# Altium project ROBO_PCB.PrjPcb
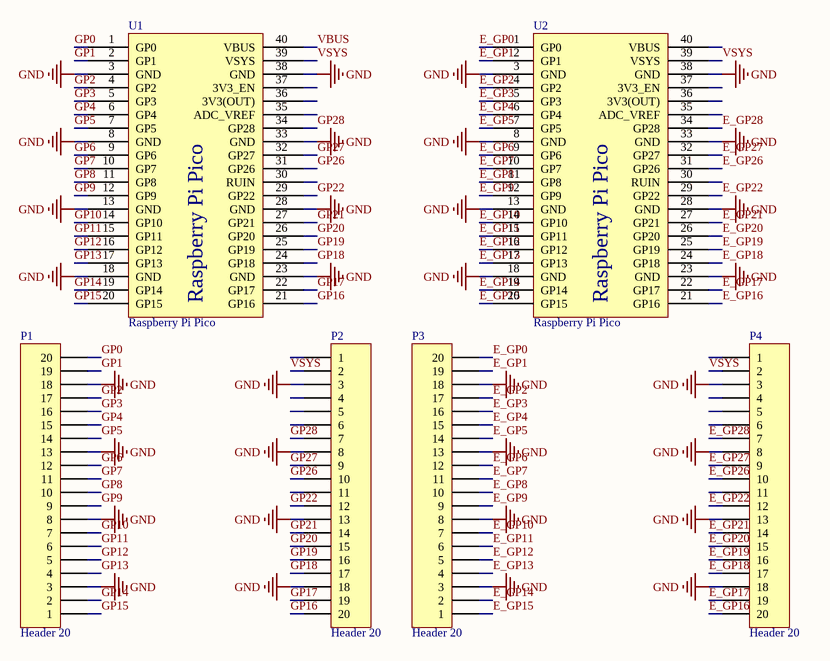
[diagram p0: PCBSchematic.SchDoc]
1 sheet, 6 parts. Net scope: global (net labels, ports and power ports of the same name join across sheets).

## Sheet PCBSchematic.SchDoc
size Letter; SheetNumber: 1; SheetTotal: 1

### Parts
P1  Header 20  [HDR1X20]
P2  Header 20  [HDR1X20]
P3  Header 20  [HDR1X20]
P4  Header 20  [HDR1X20]
U1  Raspberry Pi Pico  [Raspberry Pi Pico]
U2  Raspberry Pi Pico  [Raspberry Pi Pico]

### Nets
GND: P1.3 P1.8 P1.13 P1.18 P2.3 P2.8 P2.13 P2.18 P3.3 P3.8 P3.13 P3.18 P4.3 P4.8 P4.13 P4.18 U1.3(GND) U1.8(GND) U1.13(GND) U1.18(GND) U1.23(GND) U1.28(GND) U1.33(GND) U1.38(GND) U2.3(GND) U2.8(GND) U2.13(GND) U2.18(GND) U2.23(GND) U2.28(GND) U2.33(GND) U2.38(GND)
E_GP0: P3.20 U2.1(GP0)
E_GP1: P3.19 U2.2(GP1)
E_GP2: P3.17 U2.4(GP2)
E_GP3: P3.16 U2.5(GP3)
E_GP4: P3.15 U2.6(GP4)
E_GP5: P3.14 U2.7(GP5)
E_GP6: P3.12 U2.9(GP6)
E_GP7: P3.11 U2.10(GP7)
E_GP8: P3.10 U2.11(GP8)
E_GP9: P3.9 U2.12(GP9)
E_GP10: P3.7 U2.14(GP10)
E_GP11: P3.6 U2.15(GP11)
E_GP12: P3.5 U2.16(GP12)
E_GP13: P3.4 U2.17(GP13)
E_GP14: P3.2 U2.19(GP14)
E_GP15: P3.1 U2.20(GP15)
E_GP16: P4.20 U2.21(GP16)
E_GP17: P4.19 U2.22(GP17)
E_GP18: P4.17 U2.24(GP18)
E_GP19: P4.16 U2.25(GP19)
E_GP20: P4.15 U2.26(GP20)
E_GP21: P4.14 U2.27(GP21)
E_GP22: P4.12 U2.29(GP22)
E_GP26: P4.10 U2.31(GP26)
E_GP27: P4.9 U2.32(GP27)
E_GP28: P4.7 U2.34(GP28)
GP0: P1.20 U1.1(GP0)
GP1: P1.19 U1.2(GP1)
GP2: P1.17 U1.4(GP2)
GP3: P1.16 U1.5(GP3)
GP4: P1.15 U1.6(GP4)
GP5: P1.14 U1.7(GP5)
GP6: P1.12 U1.9(GP6)
GP7: P1.11 U1.10(GP7)
GP8: P1.10 U1.11(GP8)
GP9: P1.9 U1.12(GP9)
GP10: P1.7 U1.14(GP10)
GP11: P1.6 U1.15(GP11)
GP12: P1.5 U1.16(GP12)
GP13: P1.4 U1.17(GP13)
GP14: P1.2 U1.19(GP14)
GP15: P1.1 U1.20(GP15)
GP16: P2.20 U1.21(GP16)
GP17: P2.19 U1.22(GP17)
GP18: P2.17 U1.24(GP18)
GP19: P2.16 U1.25(GP19)
GP20: P2.15 U1.26(GP20)
GP21: P2.14 U1.27(GP21)
GP22: P2.12 U1.29(GP22)
GP26: P2.10 U1.31(GP26)
GP27: P2.9 U1.32(GP27)
GP28: P2.7 U1.34(GP28)
VBUS: U1.40(VBUS)
VSYS: P2.2 P4.2 U1.39(VSYS) U2.39(VSYS)

Not connected (* = marked no-connect by the designer): P2 1 4 5 6 11; P4 1 4 5 6 11; U1 30(RUIN) 35(ADC_VREF) 36(3V3(OUT)) 37(3V3_EN); U2 30(RUIN) 35(ADC_VREF) 36(3V3(OUT)) 37(3V3_EN) 40(VBUS)

### Library data of the parts
P1-P4 = Header 20: Header, 20-Pin; LatestRevisionDate: 17-Jul-2002; LatestRevisionNote: Re-released for DXP Platform.; Publisher: Altium Limited